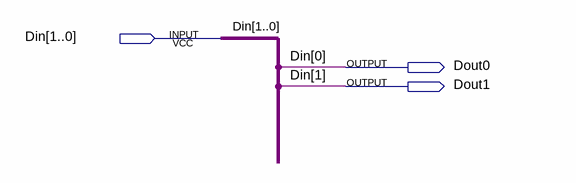
[diagram p0: schematic sheet]
// Quartus schematic cvt_2x1_1x2.bdf as structural Verilog: 0 symbols, 3 pins
module cvt_2x1_1x2 (
  input  [1:0] Din,
  output Dout0,
  output Dout1
);


  assign Dout0 = Din[0];
  assign Dout1 = Din[1];
endmodule
